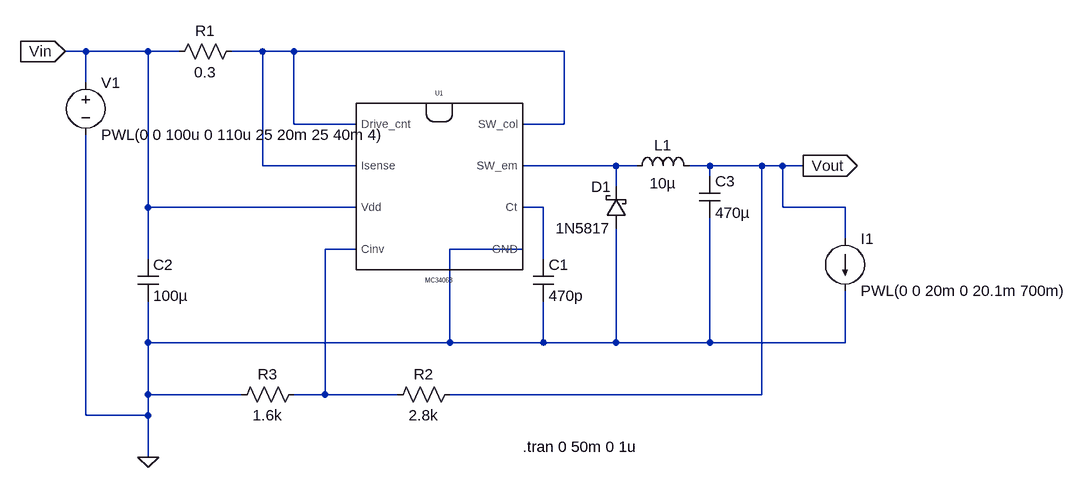
[diagram p0: schematic NJM2360M.asc]
NJM2360M.asc, the LTspice schematic file:
Version 4
SHEET 1 1312 680
WIRE -224 32 -256 32
WIRE -128 32 -224 32
WIRE -80 32 -128 32
WIRE 48 32 0 32
WIRE 96 32 48 32
WIRE 512 32 96 32
WIRE -224 80 -224 32
WIRE 96 144 96 32
WIRE 192 144 96 144
WIRE 512 144 512 32
WIRE 512 144 448 144
WIRE 48 208 48 32
WIRE 192 208 48 208
WIRE 592 208 448 208
WIRE 624 208 592 208
WIRE 736 208 704 208
WIRE 816 208 736 208
WIRE 848 208 816 208
WIRE 880 208 848 208
WIRE 736 224 736 208
WIRE 592 240 592 208
WIRE -128 272 -128 32
WIRE 192 272 -128 272
WIRE 480 272 448 272
WIRE 848 272 848 208
WIRE 944 272 848 272
WIRE 944 320 944 272
WIRE 192 336 144 336
WIRE 448 336 336 336
WIRE -128 352 -128 272
WIRE 480 352 480 272
WIRE -128 480 -128 416
WIRE 336 480 336 336
WIRE 336 480 -128 480
WIRE 480 480 480 416
WIRE 480 480 336 480
WIRE 592 480 592 304
WIRE 592 480 480 480
WIRE 736 480 736 288
WIRE 736 480 592 480
WIRE 944 480 944 400
WIRE 944 480 736 480
WIRE -128 560 -128 480
WIRE 16 560 -128 560
WIRE 144 560 144 336
WIRE 144 560 96 560
WIRE 256 560 144 560
WIRE 816 560 816 208
WIRE 816 560 336 560
WIRE -224 592 -224 160
WIRE -128 592 -128 560
WIRE -128 592 -224 592
WIRE -128 656 -128 592
FLAG -128 656 0
FLAG 880 208 Vout
IOPIN 880 208 Out
FLAG -256 32 Vin
IOPIN -256 32 In
SYMBOL MC34063 320 240 R0
SYMATTR InstName U1
SYMBOL cap 464 352 R0
SYMATTR InstName C1
SYMATTR Value 470p
SYMBOL cap -144 352 R0
SYMATTR InstName C2
SYMATTR Value 100µ
SYMBOL cap 720 224 R0
SYMATTR InstName C3
SYMATTR Value 470µ
SYMBOL res 16 16 R90
WINDOW 0 0 56 VBottom 2
WINDOW 3 32 56 VTop 2
SYMATTR InstName R1
SYMATTR Value 0.3
SYMBOL ind 608 224 R270
WINDOW 0 32 56 VTop 2
WINDOW 3 5 56 VBottom 2
SYMATTR InstName L1
SYMATTR Value 10µ
SYMBOL schottky 608 304 R180
WINDOW 0 24 64 Left 2
WINDOW 3 24 0 Left 2
SYMATTR InstName D1
SYMATTR Value 1N5817
SYMATTR Description Diode
SYMATTR Type diode
SYMBOL res 352 544 R90
WINDOW 0 0 56 VBottom 2
WINDOW 3 32 56 VTop 2
SYMATTR InstName R2
SYMATTR Value 2.8k
SYMBOL res 112 544 R90
WINDOW 0 0 56 VBottom 2
WINDOW 3 32 56 VTop 2
SYMATTR InstName R3
SYMATTR Value 1.6k
SYMBOL voltage -224 64 R0
WINDOW 123 0 0 Left 0
WINDOW 39 0 0 Left 0
SYMATTR InstName V1
SYMATTR Value PWL(0 0 100u 0 110u 25 20m 25 40m 4)
SYMBOL current 944 320 R0
WINDOW 123 0 0 Left 0
WINDOW 39 0 0 Left 0
SYMATTR InstName I1
SYMATTR Value PWL(0 0 20m 0 20.1m 700m)
TEXT 448 640 Left 2 !.tran 0 50m 0 1u

The netlist it stands for:
* NJM2360M.asc
XU1 N001 N002 N003 0 N004 Vin N001 N001 MC34063  ; pins SW_col SW_em Ct GND Cinv Vdd Isense Drive_cnt
C1 N003 0 470p
C2 Vin 0 100µ
C3 Vout 0 470µ
R1 N001 Vin 0.3
L1 N002 Vout 10µ
D1 0 N002 1N5817
R2 Vout N004 2.8k
R3 N004 0 1.6k
V1 Vin 0 PWL(0 0 100u 0 110u 25 20m 25 40m 4)
I1 Vout 0 PWL(0 0 20m 0 20.1m 700m)
.model D D
.lib standard.dio
.tran 0 50m 0 1u
.lib MC34063.lib
.backanno
.end